# Altium project Soldering_Trainer_Prj.PrjPCB
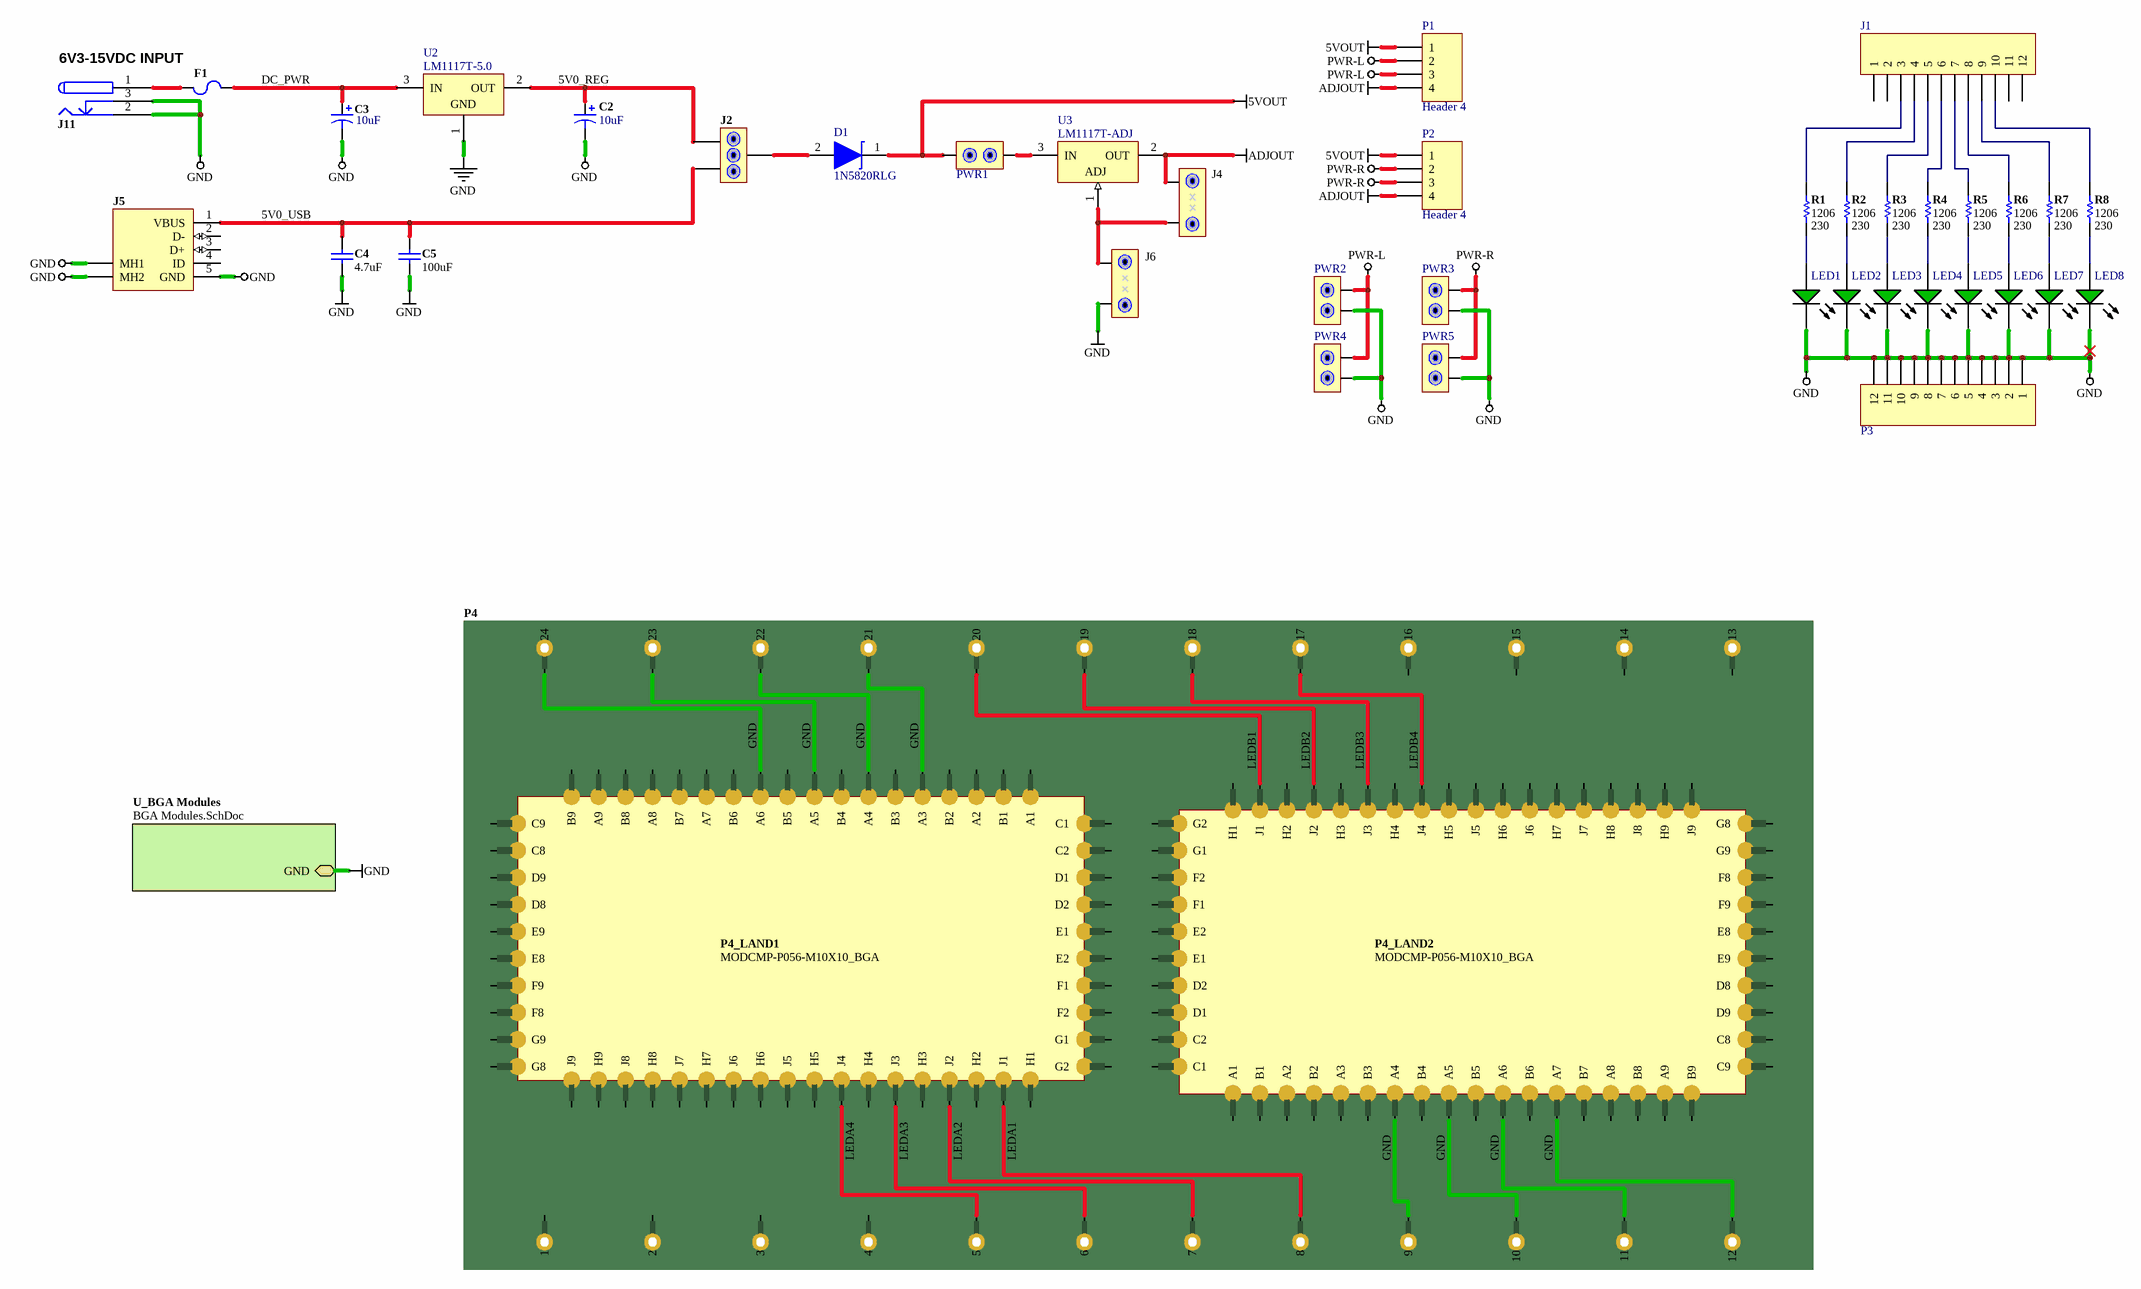
[diagram p0: Devices.SchDoc]
5 sheets, 68 parts. Net scope: hierarchical (ports join the sheet entries above them; power ports are global).
Board files: Soldering_Trainer_PCB.PcbDoc, BGA Breakout.PcbDoc, BGA Modules.PcbDoc, LED Breakout Board.PcbDoc, BB Power Supply.PcbDoc
Sheets:
  Devices.SchDoc
    U_BGA Modules = BGA Modules.SchDoc
      U_BGA LEDs A = BGA LEDs A.SchDoc
      U_BGA LEDs B = BGA LEDs B.SchDoc
      U_BGA LEDs C = BGA LEDs C.SchDoc

## Sheet Devices.SchDoc: Schematic Sheet Test Title
size C; Organization: CXQ; Address1: RM 7401, 550 Jumen Rd, Huangpu District, Shanghai, China; Address2: Huangpu District; Address3: Shanghai; Address4: China; Revision: MB0004-01.A.1; SheetNumber: 1; SheetTotal: 99; PageSetup: Record=PageOptions|CenterHorizontal=True|CenterVertical=True|PrintScale=0.98|XCorrection=1.00|YCorrection=1.00|PrintKind=0|BorderSize=5000000|LeftOffset=0|BottomOffset=0|Orientation=2|PaperLength=1000|PaperWidth=1000|Scale=100|PaperSource=7|PrintQuality=-4|MediaType=1|DitherType=10|PaperKind=A4|PrintScaleMode=1; ProjectName: Project Name

### Parts
C2  Capacitance: 10uF  [AVX-CAPC3528_V]  (hidden comment: TAJB106K020R)
C3  Capacitance: 10uF  [AVX-CAPC3528_V]  (hidden comment: TAJB106K020R)
C4  value 4.7uF  [CAPC1206(3216)190_L]  (hidden comment: AP 4.7uF 6.3V 1206(3216))
C5  value 100uF  [CAPC1206(3216)190_L]  (hidden comment: AP 100uF 6.3V 1206(3216))
D1  1N5820RLG  [ONSC-AXIAL_LEAD-2-267-05_V]
F1  SMD2920P300TF  [FUSE2920]  (value not drawn)
J1  Header 12  [HDR1X12]  (value not drawn)
J2  3-WAY JUMPER  [HDR1X3]  (value not drawn)
J4  801-87-004-10-001101  [HDR1X4]  (value not drawn)
J5  UX60SC-MB-5S8  [UX60SC-MB-5S8]  (value not drawn)
J6  801-87-004-10-001101  [HDR1X4]  (value not drawn)
J11  PWR CONNECTOR  [PJ-102AH]  (value not drawn)
LED1  LED_1206  [RESC1206(3216)75_L]  (value not drawn)
LED2  LED_1206  [RESC1206(3216)75_L]  (value not drawn)
LED3  LED_1206  [RESC1206(3216)75_L]  (value not drawn)
LED4  LED_1206  [RESC1206(3216)75_L]  (value not drawn)
LED5  LED_1206  [RESC1206(3216)75_L]  (value not drawn)
LED6  LED_1206  [RESC1206(3216)75_L]  (value not drawn)
LED7  LED_1206  [RESC1206(3216)75_L]  (value not drawn)
LED8  LED_1206  [RESC1206(3216)75_L]  (value not drawn)
P1  Header 4  [HDR1X4]
P2  Header 4  [HDR1X4]
P3  Header 12  [HDR1X12]  (value not drawn)
P4  BBCMP-P24-M1200X700  [BBCMP-P24-M1200X700]  (value not drawn)
P4_LAND1  MODCMP-P056-M10X10_BGA  [MB2100.01.A.2]  (no BOM)
P4_LAND2  MODCMP-P056-M10X10_BGA  [MB2100.01.A.2]  (no BOM)
PWR1  Jumper  [JMP1X2]  (value not drawn)
PWR2  Jumper  [JMP1X2]  (value not drawn)
PWR3  Jumper  [JMP1X2]  (value not drawn)
PWR4  Jumper  [JMP1X2]  (value not drawn)
PWR5  Jumper  [JMP1X2]  (value not drawn)
R1  1206  Value (Ohms): 230  [RESC1206(3216)75_L]
R2  1206  Value (Ohms): 230  [RESC1206(3216)75_L]
R3  1206  Value (Ohms): 230  [RESC1206(3216)75_L]
R4  1206  Value (Ohms): 230  [RESC1206(3216)75_L]
R5  1206  Value (Ohms): 230  [RESC1206(3216)75_L]
R6  1206  Value (Ohms): 230  [RESC1206(3216)75_L]
R7  1206  Value (Ohms): 230  [RESC1206(3216)75_L]
R8  1206  Value (Ohms): 230  [RESC1206(3216)75_L]
U2  LM1117T-5.0  [T03B]
U3  LM1117T-ADJ  [T03B]

### Sub-sheets
U_BGA Modules = BGA Modules.SchDoc: GND

### Nets
5VOUT: D1.1(K) P1.1 P2.1 PWR1.1
ADJOUT: J4.1 P1.4 P2.4 U3.2(OUT)
GND: C2.2 C3.2 C4.2 C5.2 J5.5(GND) J5.MH1 J5.MH2 J6.4 J11.2 J11.3 LED1.2(K) LED2.2(K) LED3.2(K) LED4.2(K) LED5.2(K) LED6.2(K) LED7.2(K) LED8.2(K) P3.1 P3.2 P3.3 P3.4 P3.5 P3.6 P3.7 P3.8 P3.9 P3.10 P3.11 P3.12 P4.9 P4.10 P4.11 P4.12 P4.21 P4.22 P4.23 P4.24 P4_LAND1.A3 P4_LAND1.A4 P4_LAND1.A5 P4_LAND1.A6 P4_LAND2.A4 P4_LAND2.A5 P4_LAND2.A6 P4_LAND2.A7 PWR2.1 PWR3.1 PWR4.1 PWR5.1 U2.1(GND) ; sheet U_BGA Modules/GND
PWR-L: P1.2 P1.3 PWR2.2 PWR4.2
PWR-R: P2.2 P2.3 PWR3.2 PWR5.2
5V0_REG: C2.1 J2.1 U2.2(OUT)
5V0_USB: C4.1 C5.1 J2.3 J5.1(VBUS)
DC_PWR: C3.1 F1.1 U2.3(IN)
LEDA1: P4.8 P4_LAND1.J1
LEDA2: P4.7 P4_LAND1.J2
LEDA3: P4.6 P4_LAND1.J3
LEDA4: P4.5 P4_LAND1.J4
LEDB1: P4.20 P4_LAND2.J1
LEDB2: P4.19 P4_LAND2.J2
LEDB3: P4.18 P4_LAND2.J3
LEDB4: P4.17 P4_LAND2.J4
NetD1_2: D1.2(A) J2.2
NetF1_2: F1.2 J11.1
NetJ1_3: J1.3 R1.2
NetJ1_4: J1.4 R2.2
NetJ1_5: J1.5 R3.2
NetJ1_6: J1.6 R4.2
NetJ1_7: J1.7 R5.2
NetJ1_8: J1.8 R6.2
NetJ1_9: J1.9 R7.2
NetJ1_10: J1.10 R8.2
NetJ4_4: J4.4 J6.1 U3.1(ADJ)
NetLED1_1: LED1.1(A) R1.1
NetLED2_1: LED2.1(A) R2.1
NetLED3_1: LED3.1(A) R3.1
NetLED4_1: LED4.1(A) R4.1
NetLED5_1: LED5.1(A) R5.1
NetLED6_1: LED6.1(A) R6.1
NetLED7_1: LED7.1(A) R7.1
NetLED8_1: LED8.1(A) R8.1
NetPWR1_2: PWR1.2 U3.3(IN)

Not connected (* = marked no-connect by the designer): J1 1 2 11 12; J5 2(D-) 3(D+) 4(ID); P4 1 2 3 4 13 14 15 16; P4_LAND1 A1 A2 A7 A8 A9 B1 B2 B3 B4 B5 B6 B7 B8 B9 C1 C2 C8 C9 D1 D2 D8 D9 E1 E2 E8 E9 F1 F2 F8 F9 G1 G2 G8 G9 H1 H2 H3 H4 H5 H6 H7 H8 H9 J5 J6 J7 J8 J9; P4_LAND2 A1 A2 A3 A8 A9 B1 B2 B3 B4 B5 B6 B7 B8 B9 C1 C2 C8 C9 D1 D2 D8 D9 E1 E2 E8 E9 F1 F2 F8 F9 G1 G2 G8 G9 H1 H2 H3 H4 H5 H6 H7 H8 H9 J5 J6 J7 J8 J9

### Notes on the sheet
- 6V3-15VDC INPUT
- A4
- DOCUMENT
- DATE
- TIME
- of
- SHEET
- ADDR
- FILE
- RM 7401, 550 Jumen Road
- Huangpu District, Shanghai, China
- www.mesheven.com

### Library data of the parts
C2 C3 = CMP-0279-00001-1: Capacitor, Tantalum, 10uF 10% 20V MCCT-B (3528); Manufacturer: AVX; Polarity: Polarized; PartNumber: TAJB106K020R; PackageDescription: 2-Pin SMT Capacitor, 3.5 x 2.8 mm Body; ComponentLink1URL: http://www.avx.com/; PackageReference: CAPC3528; ComponentLink2Description: Datasheet; Technology: Tantalum; ComponentLink2URL: http://www.avx.com/docs/Catalogs/taj.pdf; Tolerance: 10%; ComponentLink1Description: Manufacturer URL; Rated Voltage: 20V; DatasheetVersion: Jun-13; Mounting Technology: Surface Mount; Manufacturer_PN: TAJB106K020R; Manufacturer Part Number: TAJB106K020R
C4 C5 = CMP-0402-0000: CAP 100uF 6.3V ?0% 1206 (3216 Metric) Thickness 1.9mm SMD; Case-Metric: 3216; Case-EIA: 1206; Rated Voltage: 6.3 V; Max Thickness: 1.9 mm; Technology: SMT; Tolerance: ?0%; ID: CMP-0402-0000
D1 = CMP-1055-00027-1: Rectifier, 2-Pin Axial_Lead, Pb-Free, Tape and Reel; Manufacturer: On Semiconductor; Configuration: Single; IFSM Max (A): 80; ComponentLink3Description: Package Specification; PartNumber: 1N5820RLG; PackageReference: AXIAL_LEAD-2-267-05; Mounting Technology: Through Hole; ComponentLink3URL: http://www.onsemi.com/pub_link/Collateral/267-05.PDF; ComponentLink2Description: Datasheet; ComponentLink1URL: http://www.onsemi.com/; PackageVersion: Rev. G, 06/2000; Packing: Tape and Reel; DatasheetVersion: Rev. 10; RoHS: TRUE; ComponentLink2URL: http://www.onsemi.cn/pub_link/Collateral/1N5820-D.PDF; ComponentLink1Description: Manufacturer URL; PackageDescription: 2-Pin, Axial Lead, Diameter 5.05 mm
F1 = CMP-0204-0023: PTC RESETTABLE 16V 3A SMD 2920; Class: Discrete; Sub Class: Fuse; DefaultDesignator: F?; ID: CMP-0204-0023; Manufacturer_PN: SMD2920P300TF
J1 P3 = Header 12: Header, 12-Pin; LatestRevisionDate: 17-Jul-2002; LatestRevisionNote: Re-released for DXP Platform.; Publisher: Altium Limited
J2 = 3-WAY JUMPER: 3-Way Jumper - Center Output; Manufacturer_PN: 71417-103HLF; Manufacturer Part Number: 71417-103HLF
J4 J6 = 801-87-004-10-001101: IC REG LDO 3V3 .3A SOT25; Manufacturer Part Number: 801-87-004-10-001101; Digikey Part Number: 1212-1181-ND
J5 = CMP-0300-0119: CONN RCPT MINI USB2.0 5POS SLD; DefaultDesignator: J?; Class: Connector; Sub Class: USB; Manufacturer_PN: UX60SC-MB-5S8; ID: CMP-0300-0119; ComponentLink1Description: Datasheet; ComponentLink2Description: Manufacturer; ComponentLink1URL: http://www.hirose.co.jp/cataloge_hp/e24000153.pdf; ComponentLink2URL: http://www.hirose.com
J11 = POWER-CONNECTOR-3: Connector, 3 Conductor Power Jack; Manufacturer_PN: CP-102AH-ND; Connector type: POWERJACK 3 HEADER; ClassName: PWR_CONN_5V0; Category: Connector; Mounting Technology: PTH; Pin Count: 3; Manufacturer Part Number: CP-102AH-ND
LED1-LED8 = CMP-0201-0036: GREEN color, 1206, SMD; Manufacturer_PN: 1206-LED-GREEN; DefaultDesignator: LED?; Class: Diodes; Sub Class: LED; ID: CMP-0201-0036; Reverse Voltage DC (Vr): Green; ComponentLink1Description: Datasheet; ComponentLink2Description: Manufacturer
P1 P2 = Header 4: Header, 4-Pin; LatestRevisionDate: 17-Jul-2002; LatestRevisionNote: Re-released for DXP Platform.; Publisher: Altium Limited
P4 = BBCMP-P24: ID: MOD-0100-0197; DefaultDesignator: P?; Class: Module; Sub Class: PCB - Module; Manufacturer_PN: BBCMP-P24-M1200x700
P4_LAND1 P4_LAND2 = MODCMP-P056-M10X10_BGA: Module Component - 1mm Pitch, 56-Pin, 10mmX10mm; DefaultDesignator: P?; Sub Class: PCB - Module; ID: MOD-0100-0123; Class: Module; Manufacturer_PN: MODCMP-P056-M10X10
PWR1 = JMP1X2_SERIES: Standard 2 Pin Jumper, 100mil spacing; Manufacturer_PN: M20-9770246; Manufacturer Part Number: M20-9770246
PWR2-PWR5 = JMP1X2: Standard 2 Pin Jumper, 100mil spacing; Manufacturer_PN: M20-9770246; Manufacturer Part Number: M20-9770246
R1-R8 = CMP-0501-0000: Jumper 0805 (2012 Metric); Value: 0R; Case-Metric: 2012; Temp Coefficient ppm/°C: None; ID: CMP-0501-0000; Case-EIA: 1206; Tolerance %: None; Power: None; Technology: SMT
U2 = CMP-0062-02495-2: 800mA Low-Dropout Linear Regulator, 3-pin TO-220; Manufacturer: National Semiconductor; PackageTopMarking: NSUZXYTTE#*LM1117T*5.0; CompType: LDO IC; PowerWise: N; DatasheetVersion: Apr-2006; ComponentLink2URL: http://www.national.com/pf/LM/LM1117.html; PackageReference: T03B; ComponentLink3URL: http://www.national.com/packaging/folders/t03b.html; PackageVersion: revL, Jan-1992; RoHS: N; PackageDescription: TO-220, Molded, 3 Lead, Straight; ComponentLink1URL: http://www.national.com/ds/LM/LM1117.pdf; PinCount: 3; ComponentLink3Description: T03B Package Page; ComponentLink2Description: LM1117 Web Page; ComponentLink1Description: LM1117 Datasheet; RevisionNote: Component URLs added
U3 = CMP-0062-02492-2: 800mA Low-Dropout Linear Regulator, 3-pin TO-220, Pb-Free; Manufacturer: National Semiconductor; PackageTopMarking: NSUZXYTTE#*LM1117T*ADJ; CompType: LDO IC; PowerWise: N; ComponentLink1URL: http://www.national.com/ds/LM/LM1117.pdf; ComponentLink1Description: LM1117 Datasheet; DatasheetVersion: Apr-2006; ComponentLink2Description: LM1117 Web Page; PackageVersion: revL, Jan-1992; RoHS: Y; PackageReference: T03B; ComponentLink3Description: T03B Package Page; RevisionNote: Component URLs added; PackageDescription: TO-220, Molded, 3 Lead, Straight; ComponentLink3URL: http://www.national.com/packaging/folders/t03b.html; ComponentLink2URL: http://www.national.com/pf/LM/LM1117.html; PinCount: 3

## Sheet BGA Modules.SchDoc: Schematic Sheet Test Title
size C; Organization: CXQ; Address1: RM 7401, 550 Jumen Rd, Huangpu District, Shanghai, China; Address2: Huangpu District; Address3: Shanghai; Address4: China; Revision: MB0004-01.A.1; SheetNumber: 1; SheetTotal: 99; PageSetup: Record=PageOptions|CenterHorizontal=True|CenterVertical=True|PrintScale=0.98|XCorrection=1.00|YCorrection=1.00|PrintKind=0|BorderSize=5000000|LeftOffset=0|BottomOffset=0|Orientation=2|PaperLength=1000|PaperWidth=1000|Scale=100|PaperSource=7|PrintQuality=-4|MediaType=1|DitherType=10|PaperKind=A4|PrintScaleMode=1; ProjectName: Project Name
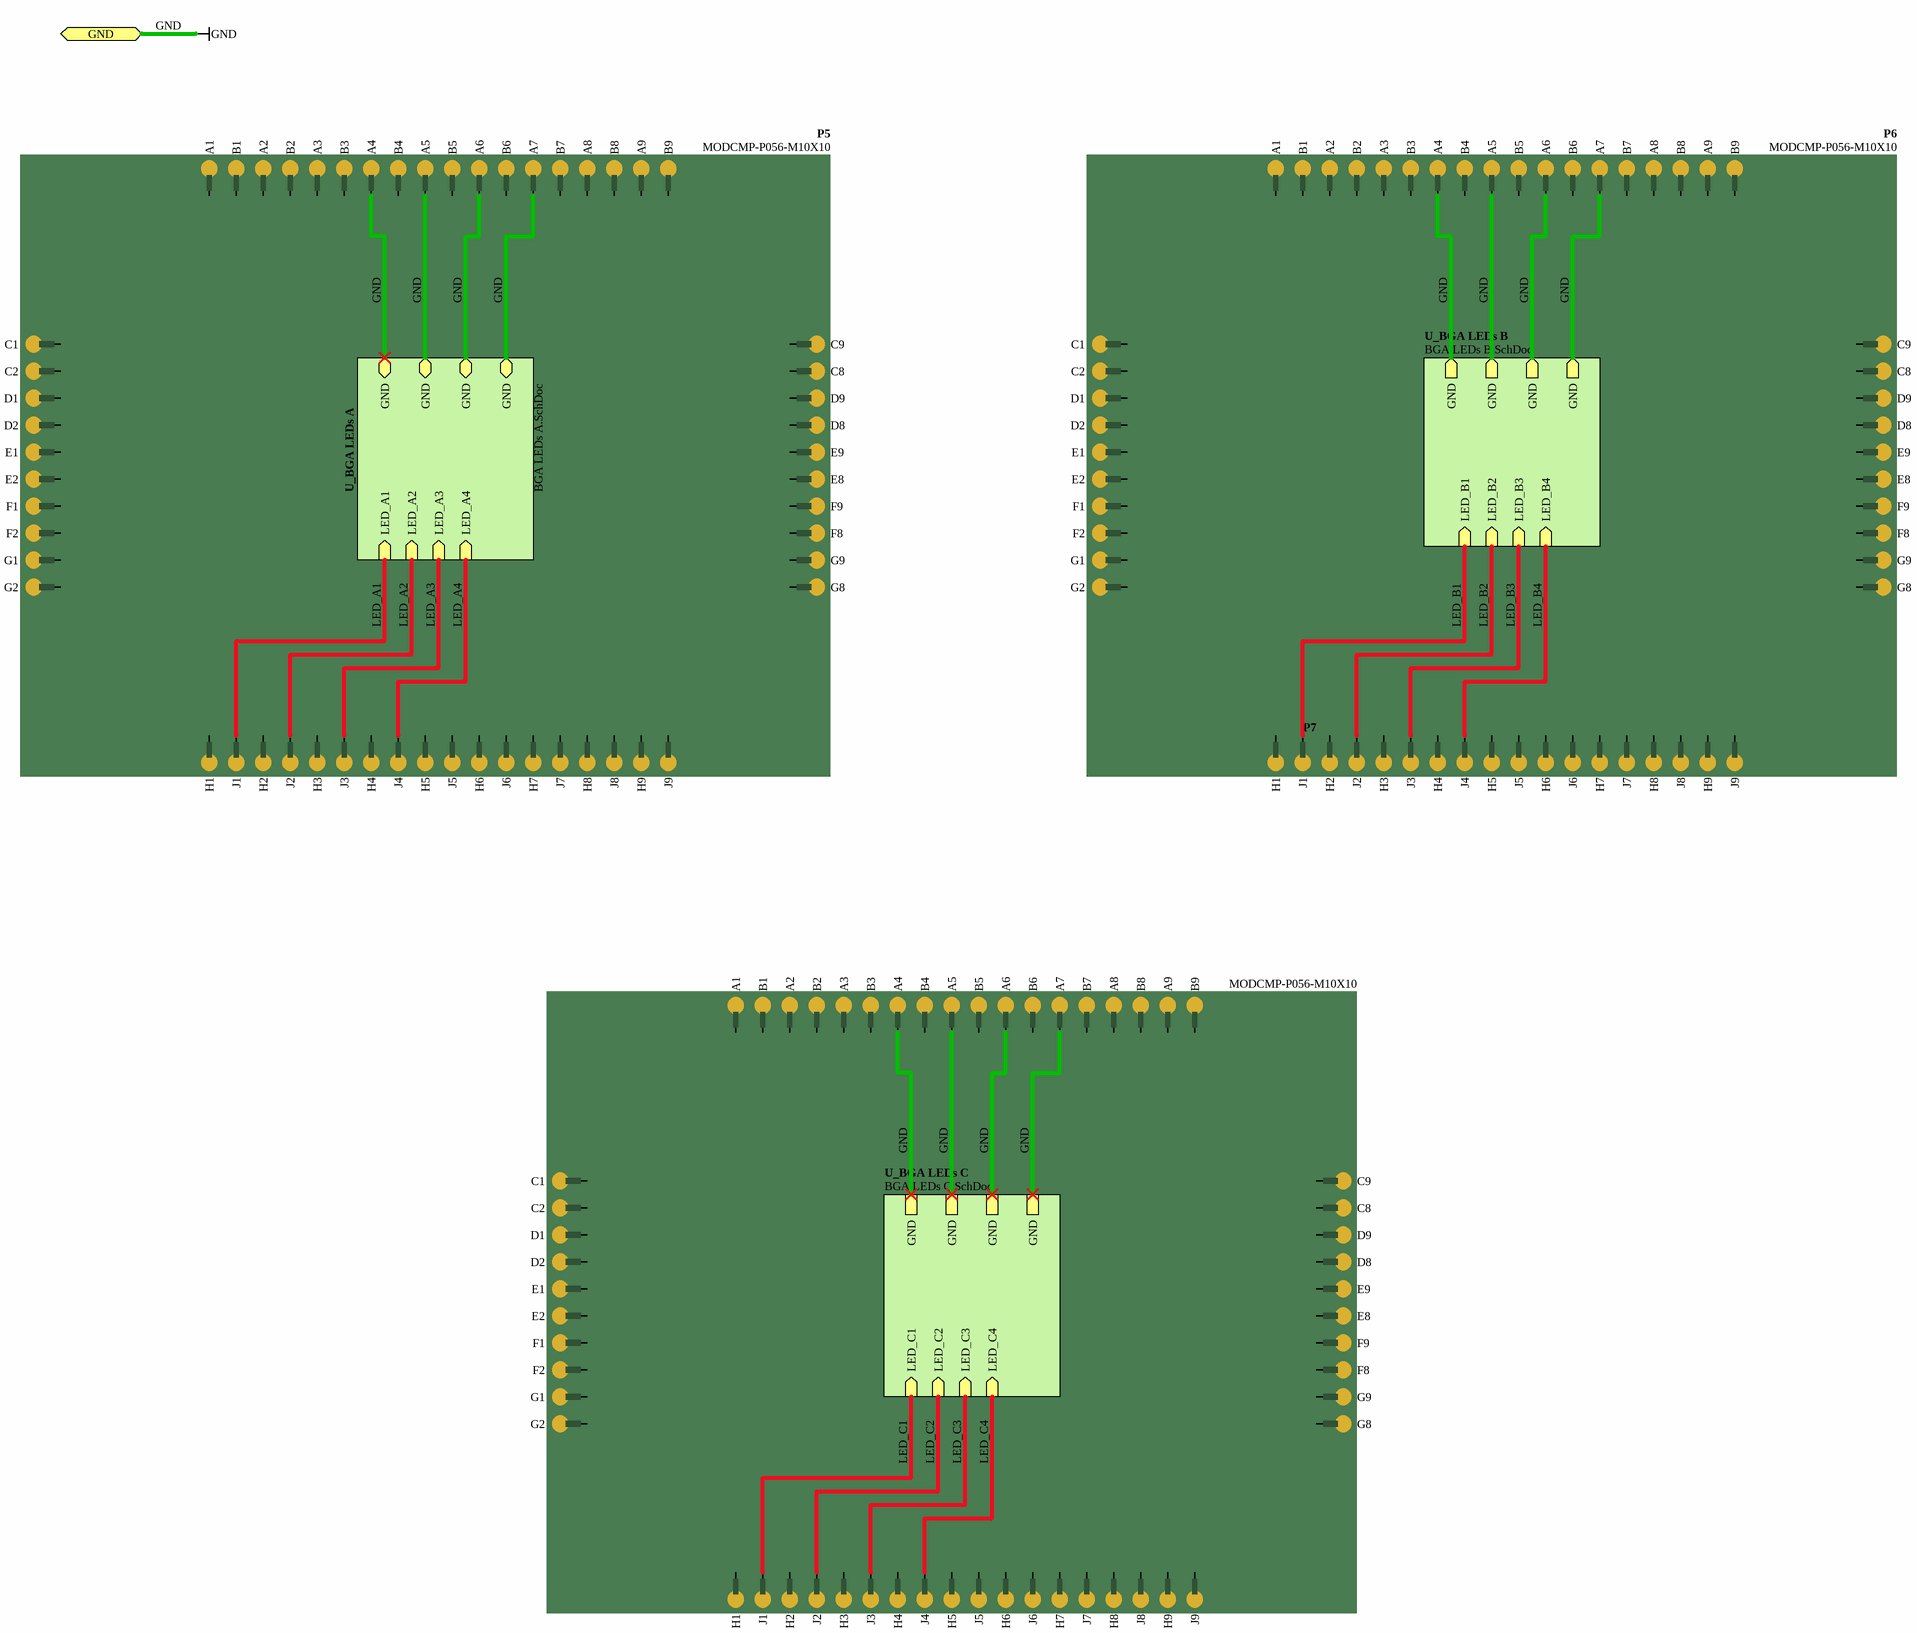
[diagram p1: BGA Modules.SchDoc]

### Parts
P5  MODCMP-P056-M10X10  [MODCMP-P056-M10X10]  (no BOM)
P6  MODCMP-P056-M10X10  [MODCMP-P056-M10X10]  (no BOM)
P7  MODCMP-P056-M10X10  [MODCMP-P056-M10X10]  (no BOM)

### Sub-sheets
U_BGA LEDs A = BGA LEDs A.SchDoc: LED_A1 (in), LED_A2 (in), LED_A3 (in), LED_A4 (in), GND, GND, GND, GND
U_BGA LEDs B = BGA LEDs B.SchDoc: LED_B1 (in), LED_B2 (in), LED_B3 (in), LED_B4 (in), GND, GND, GND, GND
U_BGA LEDs C = BGA LEDs C.SchDoc: LED_C1 (in), LED_C2 (in), LED_C3 (in), LED_C4 (in), GND, GND, GND, GND

### Ports
GND

### Nets
GND: P5.A4 P5.A5 P5.A6 P5.A7 P6.A4 P6.A5 P6.A6 P6.A7 P7.A4 P7.A5 P7.A6 P7.A7 ; port GND, sheet U_BGA LEDs A/GND, sheet U_BGA LEDs A/GND, sheet U_BGA LEDs A/GND, sheet U_BGA LEDs A/GND, sheet U_BGA LEDs B/GND, sheet U_BGA LEDs B/GND, sheet U_BGA LEDs B/GND, sheet U_BGA LEDs B/GND, sheet U_BGA LEDs C/GND, sheet U_BGA LEDs C/GND, sheet U_BGA LEDs C/GND, sheet U_BGA LEDs C/GND
LED_A1: P5.J1 ; sheet U_BGA LEDs A/LED_A1
LED_A2: P5.J2 ; sheet U_BGA LEDs A/LED_A2
LED_A3: P5.J3 ; sheet U_BGA LEDs A/LED_A3
LED_A4: P5.J4 ; sheet U_BGA LEDs A/LED_A4
LED_B1: P6.J1 ; sheet U_BGA LEDs B/LED_B1
LED_B2: P6.J2 ; sheet U_BGA LEDs B/LED_B2
LED_B3: P6.J3 ; sheet U_BGA LEDs B/LED_B3
LED_B4: P6.J4 ; sheet U_BGA LEDs B/LED_B4
LED_C1: P7.J1 ; sheet U_BGA LEDs C/LED_C1
LED_C2: P7.J2 ; sheet U_BGA LEDs C/LED_C2
LED_C3: P7.J3 ; sheet U_BGA LEDs C/LED_C3
LED_C4: P7.J4 ; sheet U_BGA LEDs C/LED_C4

Not connected (* = marked no-connect by the designer): P5 A1 A2 A3 A8 A9 B1 B2 B3 B4 B5 B6 B7 B8 B9 C1 C2 C8 C9 D1 D2 D8 D9 E1 E2 E8 E9 F1 F2 F8 F9 G1 G2 G8 G9 H1 H2 H3 H4 H5 H6 H7 H8 H9 J5 J6 J7 J8 J9; P6 A1 A2 A3 A8 A9 B1 B2 B3 B4 B5 B6 B7 B8 B9 C1 C2 C8 C9 D1 D2 D8 D9 E1 E2 E8 E9 F1 F2 F8 F9 G1 G2 G8 G9 H1 H2 H3 H4 H5 H6 H7 H8 H9 J5 J6 J7 J8 J9; P7 A1 A2 A3 A8 A9 B1 B2 B3 B4 B5 B6 B7 B8 B9 C1 C2 C8 C9 D1 D2 D8 D9 E1 E2 E8 E9 F1 F2 F8 F9 G1 G2 G8 G9 H1 H2 H3 H4 H5 H6 H7 H8 H9 J5 J6 J7 J8 J9

### Notes on the sheet
- A4
- DOCUMENT
- DATE
- TIME
- of
- SHEET
- ADDR
- FILE
- RM 7401, 550 Jumen Road
- Huangpu District, Shanghai, China
- www.mesheven.com

### Library data of the parts
P5-P7 = MOD-0100-0123: Module Component - 1mm Pitch, 56-Pin, 10mmX10mm; DefaultDesignator: P?; Sub Class: PCB - Module; Class: Module; ID: MOD-0100-0123; Manufacturer_PN: MODCMP-P056-M10X10

## Sheet BGA LEDs A.SchDoc: Schematic Sheet Test Title
size 289 x 193 mm; Organization: CXQ; Address1: RM 7401, 550 Jumen Rd, Huangpu District, Shanghai, China; Address2: Huangpu District; Address3: Shanghai; Address4: China; Revision: MB0004-01.A.1; SheetNumber: 1; SheetTotal: 99; PageSetup: Record=PageOptions|CenterHorizontal=True|CenterVertical=True|PrintScale=0.98|XCorrection=1.00|YCorrection=1.00|PrintKind=0|BorderSize=5000000|LeftOffset=0|BottomOffset=0|Orientation=2|PaperLength=1000|PaperWidth=1000|Scale=100|PaperSource=7|PrintQuality=-4|MediaType=1|DitherType=10|PaperKind=A4|PrintScaleMode=1; ProjectName: Project Name
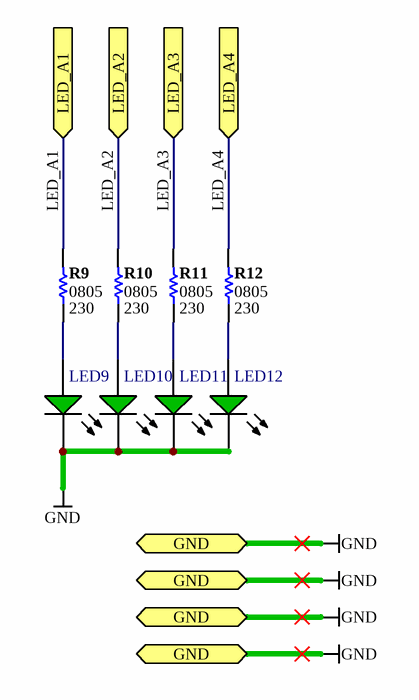
[diagram p2: BGA LEDs A.SchDoc]

### Parts
LED9  LED_1206  [RESC0805(2012)70_L]  (value not drawn)
LED10  LED_1206  [RESC0805(2012)70_L]  (value not drawn)
LED11  LED_1206  [RESC0805(2012)70_L]  (value not drawn)
LED12  LED_1206  [RESC0805(2012)70_L]  (value not drawn)
R9  0805  Value (Ohms): 230  [RESC0805(2012)70_L]
R10  0805  Value (Ohms): 230  [RESC0805(2012)70_L]
R11  0805  Value (Ohms): 230  [RESC0805(2012)70_L]
R12  0805  Value (Ohms): 230  [RESC0805(2012)70_L]

### Ports
GND, LED_A1 (in), LED_A2 (in), LED_A3 (in), LED_A4 (in)

### Nets
GND: LED9.2(K) LED10.2(K) LED11.2(K) LED12.2(K) ; port GND
LED_A1: R9.2 ; port LED_A1
LED_A2: R10.2 ; port LED_A2
LED_A3: R11.2 ; port LED_A3
LED_A4: R12.2 ; port LED_A4
NetLED9_1: LED9.1(A) R9.1
NetLED10_1: LED10.1(A) R10.1
NetLED11_1: LED11.1(A) R11.1
NetLED12_1: LED12.1(A) R12.1

### Notes on the sheet
- A4
- DOCUMENT
- DATE
- TIME
- of
- SHEET
- ADDR
- FILE
- RM 7401, 550 Jumen Road
- Huangpu District, Shanghai, China
- www.mesheven.com

### Library data of the parts
LED9-LED12 = CMP-0201-0036: as LED1 on sheet Devices; ID: CMP-0201-0036; Reverse Voltage DC (Vr): Green; ComponentLink1Description: Datasheet; ComponentLink2Description: Manufacturer
R9-R12 = CMP-0501-0000: as R1 on sheet Devices; ID: CMP-0501-0000; Case-EIA: 0805; Tolerance %: None; Power: None; Technology: SMT

## Sheet BGA LEDs B.SchDoc: Schematic Sheet Test Title
size 289 x 193 mm; Organization: CXQ; Address1: RM 7401, 550 Jumen Rd, Huangpu District, Shanghai, China; Address2: Huangpu District; Address3: Shanghai; Address4: China; Revision: MB0004-01.A.1; SheetNumber: 1; SheetTotal: 99; PageSetup: Record=PageOptions|CenterHorizontal=True|CenterVertical=True|PrintScale=0.98|XCorrection=1.00|YCorrection=1.00|PrintKind=0|BorderSize=5000000|LeftOffset=0|BottomOffset=0|Orientation=2|PaperLength=1000|PaperWidth=1000|Scale=100|PaperSource=7|PrintQuality=-4|MediaType=1|DitherType=10|PaperKind=A4|PrintScaleMode=1; ProjectName: Project Name
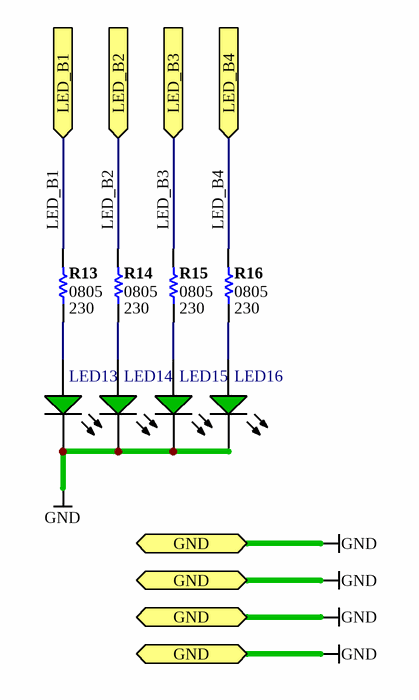
[diagram p3: BGA LEDs B.SchDoc]

### Parts
LED13  LED_1206  [RESC0805(2012)70_L]  (value not drawn)
LED14  LED_1206  [RESC0805(2012)70_L]  (value not drawn)
LED15  LED_1206  [RESC0805(2012)70_L]  (value not drawn)
LED16  LED_1206  [RESC0805(2012)70_L]  (value not drawn)
R13  0805  Value (Ohms): 230  [RESC0805(2012)70_L]
R14  0805  Value (Ohms): 230  [RESC0805(2012)70_L]
R15  0805  Value (Ohms): 230  [RESC0805(2012)70_L]
R16  0805  Value (Ohms): 230  [RESC0805(2012)70_L]

### Ports
GND, LED_B1 (in), LED_B2 (in), LED_B3 (in), LED_B4 (in)

### Nets
GND: LED13.2(K) LED14.2(K) LED15.2(K) LED16.2(K) ; port GND
LED_B1: R13.2 ; port LED_B1
LED_B2: R14.2 ; port LED_B2
LED_B3: R15.2 ; port LED_B3
LED_B4: R16.2 ; port LED_B4
NetLED13_1: LED13.1(A) R13.1
NetLED14_1: LED14.1(A) R14.1
NetLED15_1: LED15.1(A) R15.1
NetLED16_1: LED16.1(A) R16.1

### Notes on the sheet
- A4
- DOCUMENT
- DATE
- TIME
- of
- SHEET
- ADDR
- FILE
- RM 7401, 550 Jumen Road
- Huangpu District, Shanghai, China
- www.mesheven.com

### Library data of the parts
LED13-LED16 = CMP-0201-0036: as LED1 on sheet Devices; ID: CMP-0201-0036; Reverse Voltage DC (Vr): Green; ComponentLink1Description: Datasheet; ComponentLink2Description: Manufacturer
R13-R16 = CMP-0501-0000: Jumper 0805 (2012 Metric); Value: 0R; Case-EIA: 1206; Case-Metric: 2012; Temp Coefficient ppm/°C: None; ID: CMP-0501-0000; Tolerance %: None; Power: None; Technology: SMT

## Sheet BGA LEDs C.SchDoc: Schematic Sheet Test Title
size 289 x 193 mm; Organization: CXQ; Address1: RM 7401, 550 Jumen Rd, Huangpu District, Shanghai, China; Address2: Huangpu District; Address3: Shanghai; Address4: China; Revision: MB0004-01.A.1; SheetNumber: 1; SheetTotal: 99; PageSetup: Record=PageOptions|CenterHorizontal=True|CenterVertical=True|PrintScale=0.98|XCorrection=1.00|YCorrection=1.00|PrintKind=0|BorderSize=5000000|LeftOffset=0|BottomOffset=0|Orientation=2|PaperLength=1000|PaperWidth=1000|Scale=100|PaperSource=7|PrintQuality=-4|MediaType=1|DitherType=10|PaperKind=A4|PrintScaleMode=1; ProjectName: Project Name
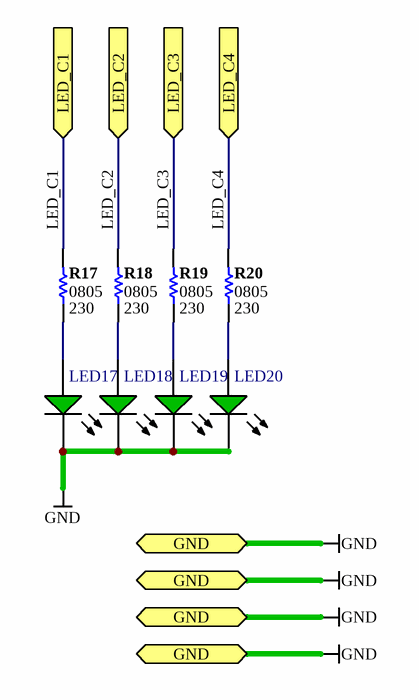
[diagram p4: BGA LEDs C.SchDoc]

### Parts
LED17  LED_1206  [RESC0805(2012)70_L]  (value not drawn)
LED18  LED_1206  [RESC0805(2012)70_L]  (value not drawn)
LED19  LED_1206  [RESC0805(2012)70_L]  (value not drawn)
LED20  LED_1206  [RESC0805(2012)70_L]  (value not drawn)
R17  0805  Value (Ohms): 230  [RESC0805(2012)70_L]
R18  0805  Value (Ohms): 230  [RESC0805(2012)70_L]
R19  0805  Value (Ohms): 230  [RESC0805(2012)70_L]
R20  0805  Value (Ohms): 230  [RESC0805(2012)70_L]

### Ports
GND, LED_C1 (in), LED_C2 (in), LED_C3 (in), LED_C4 (in)

### Nets
GND: LED17.2(K) LED18.2(K) LED19.2(K) LED20.2(K) ; port GND
LED_C1: R17.2 ; port LED_C1
LED_C2: R18.2 ; port LED_C2
LED_C3: R19.2 ; port LED_C3
LED_C4: R20.2 ; port LED_C4
NetLED17_1: LED17.1(A) R17.1
NetLED18_1: LED18.1(A) R18.1
NetLED19_1: LED19.1(A) R19.1
NetLED20_1: LED20.1(A) R20.1

### Notes on the sheet
- A4
- DOCUMENT
- DATE
- TIME
- of
- SHEET
- ADDR
- FILE
- RM 7401, 550 Jumen Road
- Huangpu District, Shanghai, China
- www.mesheven.com

### Library data of the parts
LED17-LED20 = CMP-0201-0036: as LED1 on sheet Devices; ID: CMP-0201-0036; Reverse Voltage DC (Vr): Green; ComponentLink1Description: Datasheet; ComponentLink2Description: Manufacturer
R17-R20 = CMP-0501-0000: as R1 on sheet Devices; ID: CMP-0501-0000; Case-EIA: 0805; Tolerance %: None; Power: None; Technology: SMT

## Nets that join several sheets
GND: Devices (51 pins), BGA Modules (12 pins), BGA LEDs A (LED9.2 LED10.2 LED11.2 LED12.2), BGA LEDs B (LED13.2 LED14.2 LED15.2 LED16.2), BGA LEDs C (LED17.2 LED18.2 LED19.2 LED20.2)
LED_A1: BGA Modules (P5.J1), BGA LEDs A (R9.2)
LED_A2: BGA Modules (P5.J2), BGA LEDs A (R10.2)
LED_A3: BGA Modules (P5.J3), BGA LEDs A (R11.2)
LED_A4: BGA Modules (P5.J4), BGA LEDs A (R12.2)
LED_B1: BGA Modules (P6.J1), BGA LEDs B (R13.2)
LED_B2: BGA Modules (P6.J2), BGA LEDs B (R14.2)
LED_B3: BGA Modules (P6.J3), BGA LEDs B (R15.2)
LED_B4: BGA Modules (P6.J4), BGA LEDs B (R16.2)
LED_C1: BGA Modules (P7.J1), BGA LEDs C (R17.2)
LED_C2: BGA Modules (P7.J2), BGA LEDs C (R18.2)
LED_C3: BGA Modules (P7.J3), BGA LEDs C (R19.2)
LED_C4: BGA Modules (P7.J4), BGA LEDs C (R20.2)